# Altium project MB672.PrjPCB (part 2 of 2)

## Sheet SD&Smart Card.SchDoc
size A4; Revision: D.1(PCB.SCH)
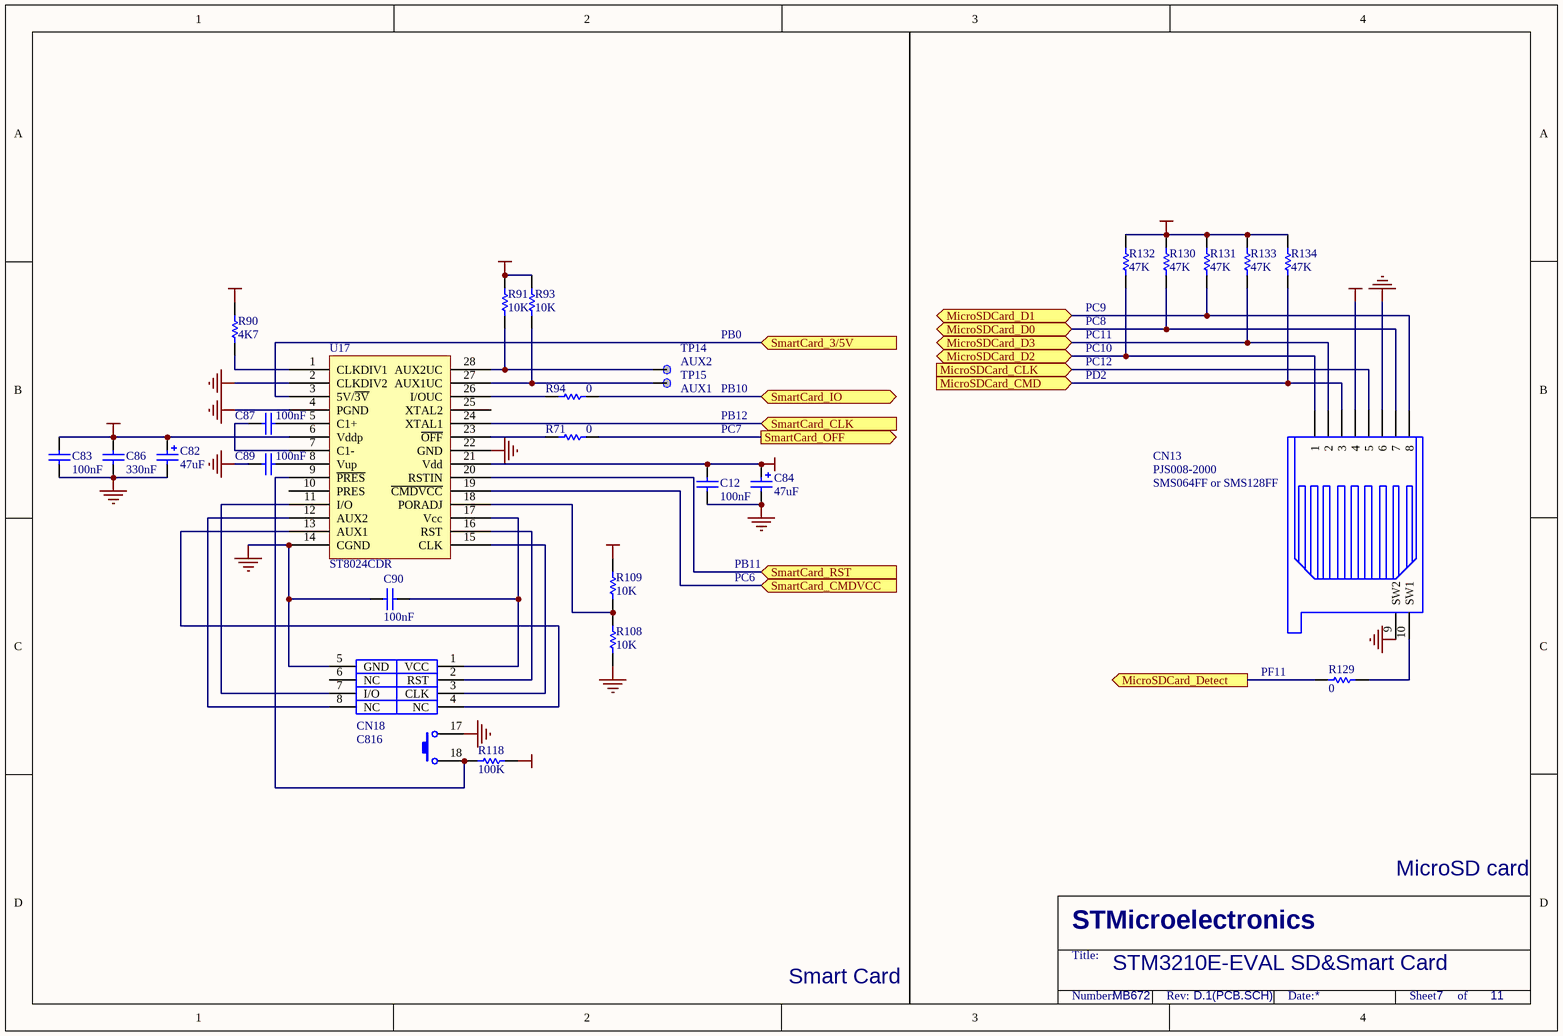
[diagram p9: SD&Smart Card.SchDoc]

### Parts
C12  100nF  [0603P]
C82  47uF  [TAN-B]
C83  100nF  [0603P]
C84  47uF  [TAN-B]
C86  330nF  [0603]
C87  100nF  [0603P]
C89  100nF  [0603P]
C90  100nF  [0603P]
CN13  PJS008-2000  [MSD(PJS008)]
CN18  C816  [SAM(C816)]
R71  0  [0805]
R90  4K7  [0603]
R91  10K  [0603]
R93  10K  [0603]
R94  0  [0805]
R108  10K  [0603]
R109  10K  [0603]
R118  100K  [0603]
R129  0  [0603]
R130  47K  [0805]
R131  47K  [0805]
R132  47K  [0805]
R133  47K  [0805]
R134  47K  [0805]
TP14  AUX2  [TP]
TP15  AUX1  [TP]
U17  ST8024CDR  [SO28]

### Ports
MicroSDCard_CLK (in), MicroSDCard_CMD (in), MicroSDCard_D0 (bidir), MicroSDCard_D1 (bidir), MicroSDCard_D2 (bidir), MicroSDCard_D3 (bidir), MicroSDCard_Detect (out), SmartCard_3/5V (in), SmartCard_CLK (in), SmartCard_CMDVCC (in), SmartCard_IO (bidir), SmartCard_OFF (out), SmartCard_RST (in)

### Nets
+3V3: C12.1 C84.1 CN13.4 R90.1 R91.1 R93.1 R109.1 R118.1 R130.1 R131.1 R132.1 R133.1 R134.1 U17.21(Vdd)
+5V: C82.1 C83.1 C86.1 U17.6(Vddp)
GND: C12.2 C82.2 C83.2 C84.2 C86.2 C89.2 C90.1 CN13.6 CN13.9(SW2) CN18.5(GND) CN18.17 R108.2 U17.2(CLKDIV2) U17.4(PGND) U17.14(CGND) U17.22(GND)
PB0: U17.3(5V/~{3V}) ; port SmartCard_3/5V
PB10: R94.2 ; port SmartCard_IO
PB11: U17.20(RSTIN) ; port SmartCard_RST
PB12: U17.24(XTAL1) ; port SmartCard_CLK
PC9: CN13.8 R131.2 ; port MicroSDCard_D1
PC10: CN13.1 R132.2 ; port MicroSDCard_D2
PC11: CN13.2 R133.2 ; port MicroSDCard_D3
PC12: CN13.5 ; port MicroSDCard_CLK
PD2: CN13.3 R134.2 ; port MicroSDCard_CMD
PF11: R129.1 ; port MicroSDCard_Detect
NetC87_1: C87.1 U17.7(C1-)
NetC87_2: C87.2 U17.5(C1+)
NetC89_1: C89.1 U17.8(Vup)
NetC90_2: C90.2 CN18.1(VCC) U17.17(Vcc)
NetCN13_7: CN13.7 R130.2 ; port MicroSDCard_D0
NetCN13_10: CN13.10(SW1) R129.2
NetCN18_2: CN18.2(RST) U17.16(RST)
NetCN18_3: CN18.3(CLK) U17.15(CLK)
NetCN18_4: CN18.4(NC) U17.13(AUX1)
NetCN18_7: CN18.7(I/O) U17.11(I/O)
NetCN18_8: CN18.8(NC) U17.12(AUX2)
NetCN18_18: CN18.18 R118.2 U17.9(~{PRES})
NetJP15_2: U17.19(~{CMDVCC}) ; port SmartCard_CMDVCC
NetJP16_2: R71.1 ; port SmartCard_OFF
NetR71_2: R71.2 U17.23(~{OFF})
NetR90_2: R90.2 U17.1(CLKDIV1)
NetR91_2: R91.2 TP14.1 U17.28(AUX2UC)
NetR93_2: R93.2 TP15.1 U17.27(AUX1UC)
NetR94_1: R94.1 U17.26(I/OUC)
NetR108_1: R108.1 R109.2 U17.18(PORADJ)

Not connected (* = marked no-connect by the designer): CN18 6(NC); U17 10(PRES) 25(XTAL2)

### Notes on the sheet
- (near R132) PC9
- PB0
- (near R132) PC8
- PC10
- PC11
- PD2
- PC12
- PB12
- PC7
- PB10
- (near CN13) SMS064FF or SMS128FF
- PC6
- PB11
- PF11
- MicroSD card
- Smart Card
- STM3210E-EVAL SD&Smart Card
- MB672
- 7
- 11
- STMicroelectronics
- Title:
- Number:
- Rev:
- Date:
- Sheet       of

### Library data of the parts
C12 C83 C87 C89 C90 = CAP: Capacitor; Published: 8-Jun-2000; Revision: July-2002: Re-released for DXP Platform.; Publisher: Altium Limited; Value: 100nF
C82 C84 = Cap Pol1: Polarized Capacitor (Radial); Value: 100pF; Published: 8-Jun-2000; Revision: July-2002: Re-released for DXP Platform.; Publisher: Altium Limited
C86 = CAP: Capacitor; Value: 100nF; Published: 8-Jun-2000; Revision: July-2002: Re-released for DXP Platform.; Publisher: Altium Limited
CN13 = SMS016AFA5E
CN18 = Smart_card_CN
R71 R90 R91 R93 R94 R108 R109 R118 R129-R134 = Res1: Resistor; Value: 1K; Published: 8-Jun-2000; Revision: July-2002: Re-released for DXP Platform.; Publisher: Altium Limited
TP14 TP15 = TP
U17 = ST8024CTR

## Sheet LCD&Joystick.SchDoc
size A4; Revision: D.1(PCB.SCH)
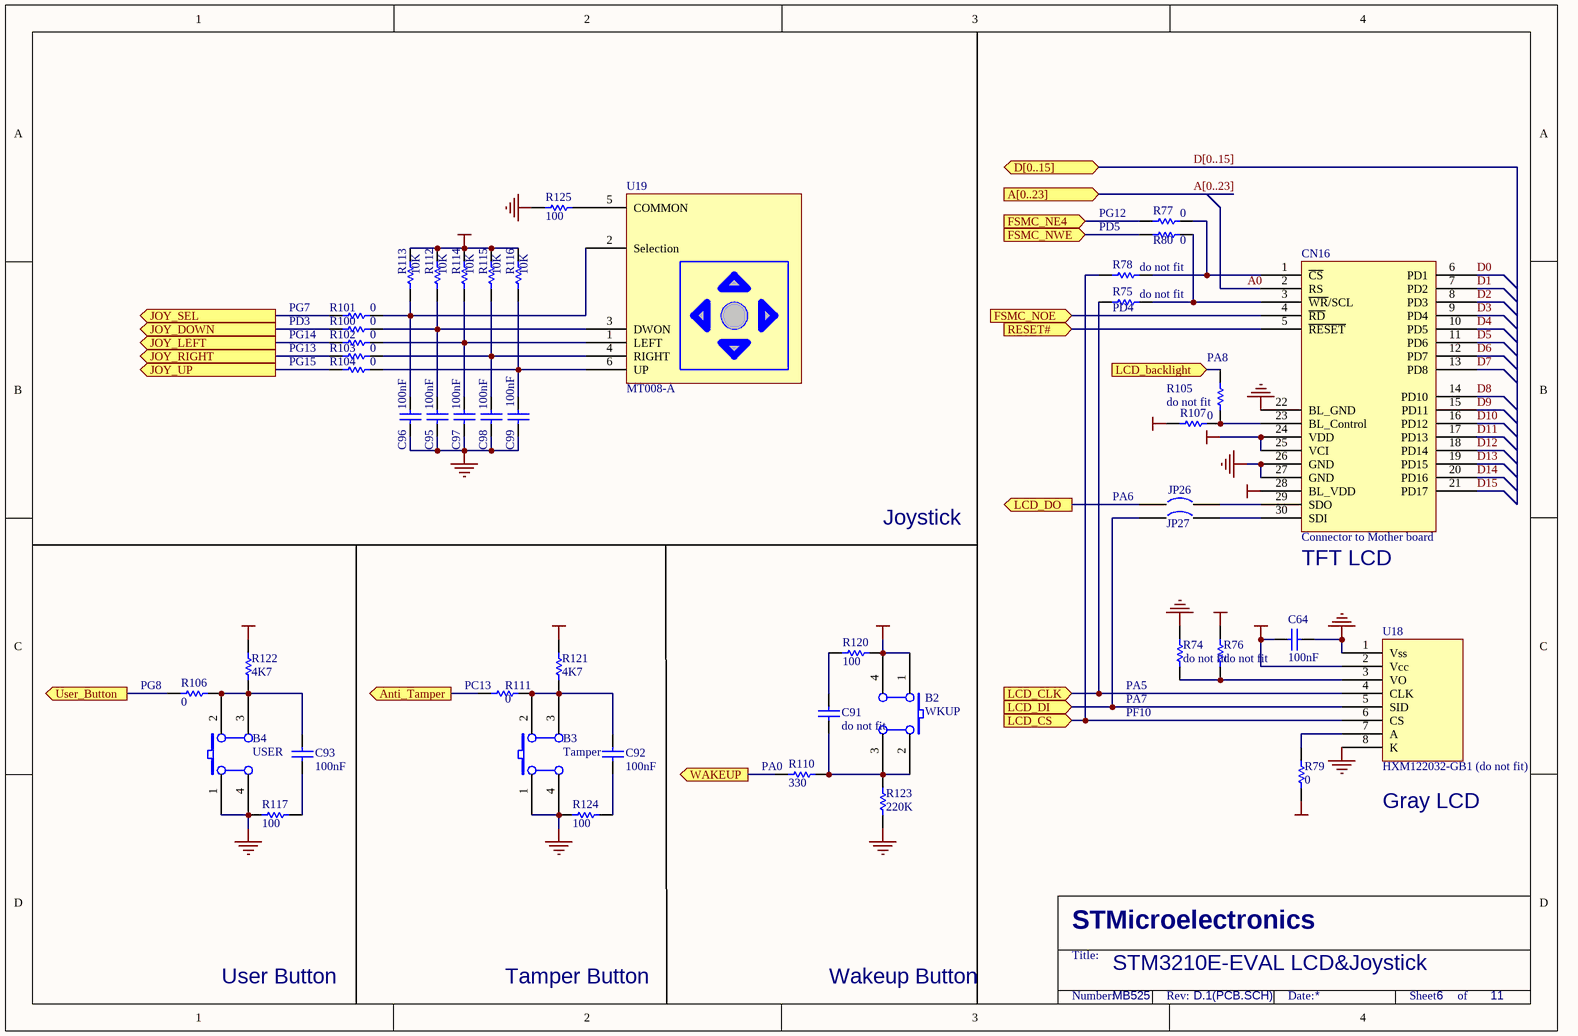
[diagram p10: LCD&Joystick.SchDoc]

### Parts
B2  WKUP  [PB10]
B3  Tamper  [PB10]
B4  USER  [PB10]
C64  100nF  [0603P]
C91  do not fit  [0603P]
C92  100nF  [0603P]
C93  100nF  [0603P]
C95  100nF  [0603P]
C96  100nF  [0603P]
C97  100nF  [0603P]
C98  100nF  [0603P]
C99  100nF  [0603P]
CN16  Connector to Mother board  [AM240320A]
JP26  (no value)  [SPST-2]
JP27  (no value)  [SPST-2]
R74  do not fit  [0603]
R75  do not fit  [0603]
R76  do not fit  [0603]
R77  0  [0603]
R78  do not fit  [0603]
R79  0  [0603]
R80  0  [0603]
R100  0  [0805]
R101  0  [0805]
R102  0  [0805]
R103  0  [0805]
R104  0  [0805]
R105  do not fit  [0603]
R106  0  [0805]
R107  0  [0603]
R110  330  [0805]
R111  0  [0805]
R112  10K  [0603]
R113  10K  [0603]
R114  10K  [0603]
R115  10K  [0603]
R116  10K  [0603]
R117  100  [0603]
R120  100  [0603]
R121  4K7  [0603]
R122  4K7  [0603]
R123  220K  [0603]
R124  100  [0603]
R125  100  [0603]
U18  HXM122032-GB1 (do not fit)  [LCD12232-GB1]
U19  MT008-A  [JOY]

### Ports
A[0..23] (in), Anti_Tamper (out), D[0..15] (bidir), FSMC_NE4 (in), FSMC_NOE (in), FSMC_NWE (in), JOY_DOWN (out), JOY_LEFT (out), JOY_RIGHT (out), JOY_SEL (out), JOY_UP (out), LCD_backlight (in), LCD_CLK (in), LCD_CS (in), LCD_DI (in), LCD_DO (out), RESET# (in), User_Button (out), WAKEUP (out)

### Nets
+3V3: B2.1(A0) B2.4(A1) C64.1 CN16.24(VDD) CN16.25(VCI) CN16.28(BL_VDD) R76.2 R107.2 R112.2 R113.1 R114.2 R115.2 R116.2 R120.1 R121.2 R122.2 U18.2(Vcc)
+5V: R79.1
GND: B3.1(A0) B3.4(A1) B4.1(A0) B4.4(A1) C64.2 C95.1 C96.1 C97.1 C98.1 C99.1 CN16.22(BL_GND) CN16.26(GND) CN16.27(GND) R74.1 R117.1 R123.2 R124.1 R125.1 U18.1(Vss) U18.8(K)
A0: CN16.2(RS)
D0: CN16.6(PD1)
D1: CN16.7(PD2)
D2: CN16.8(PD3)
D3: CN16.9(PD4)
D4: CN16.10(PD5)
D5: CN16.11(PD6)
D6: CN16.12(PD7)
D7: CN16.13(PD8)
D8: CN16.14(PD10)
D9: CN16.15(PD11)
D10: CN16.16(PD12)
D11: CN16.17(PD13)
D12: CN16.18(PD14)
D13: CN16.19(PD15)
D14: CN16.20(PD16)
D15: CN16.21(PD17)
PA0: R110.2 ; port WAKEUP
PA5: R75.2 U18.4(CLK) ; port LCD_CLK
PA6: JP26.1 ; port LCD_DO
PA7: JP27.1 U18.5(SID) ; port LCD_DI
PA8: R105.2 ; port LCD_backlight
PC13: R111.2 ; port Anti_Tamper
PD3: R100.2 ; port JOY_DOWN
PD4: CN16.4(~{RD}) ; port FSMC_NOE
PD5: R80.1 ; port FSMC_NWE
PF10: R78.1 U18.6(CS) ; port LCD_CS
PG7: R101.2 ; port JOY_SEL
PG8: R106.2 ; port User_Button
PG12: R77.1 ; port FSMC_NE4
PG13: R103.2 ; port JOY_RIGHT
PG14: R102.2 ; port JOY_LEFT
PG15: R104.2 ; port JOY_UP
RESET#: CN16.5(~{RESET}) ; port RESET#
NetB2_2: B2.2(B0) B2.3(B1) C91.2 R110.1 R123.1
NetB3_2: B3.2(B0) B3.3(B1) C92.2 R111.1 R121.1
NetB4_2: B4.2(B0) B4.3(B1) C93.2 R106.1 R122.1
NetC91_1: C91.1 R120.2
NetC92_1: C92.1 R124.2
NetC93_1: C93.1 R117.2
NetC95_2: C95.2 R100.1 R112.1 U19.3(DWON)
NetC96_2: C96.2 R101.1 R113.2 U19.2(Selection)
NetC97_2: C97.2 R102.1 R114.1 U19.1(LEFT)
NetC98_2: C98.2 R103.1 R115.1 U19.4(RIGHT)
NetC99_2: C99.2 R104.1 R116.1 U19.6(UP)
NetCN16_1: CN16.1(~{CS}) R77.2 R78.2
NetCN16_3: CN16.3(~{WR}/SCL) R75.1 R80.2
NetCN16_23: CN16.23(BL_Control) R105.1 R107.1
NetCN16_29: CN16.29(SDO) JP26.2
NetCN16_30: CN16.30(SDI) JP27.2
NetR74_2: R74.2 R76.1 U18.3(VO)
NetR79_2: R79.2 U18.7(A)
NetR125_2: R125.2 U19.5(COMMON)

### Buses and harness runs
bus A[0..23] = port A[0..23]
bus D[0..15] = port D[0..15]

### Notes on the sheet
- PG12
- PD5
- PG7
- (near R75) PD4
- PD3
- PG14
- PG13
- PG15
- (near R105) PA8
- PA6
- Joystick
- (near CN16) TFT LCD
- (near R106) PG8
- (near R111) PC13
- (near R74) PA5
- (near R74) PA7
- (near R74) PF10
- (near R110) PA0
- (near U18) Gray LCD
- User Button
- Tamper Button
- Wakeup Button
- STM3210E-EVAL LCD&Joystick
- MB525
- 6
- 11
- STMicroelectronics
- Title:
- Number:
- Rev:
- Date:
- Sheet       of

### Library data of the parts
B2-B4 = SW PUSHBUTTON: SE PUSHBUTTON
C64 C91-C93 C95-C99 = CAP: Capacitor; Value: 100pF; Published: 8-Jun-2000; Revision: July-2002: Re-released for DXP Platform.; Publisher: Altium Limited
CN16 = ColorLCD_module
JP26 JP27 = Circuit Breaker: Published: 24-Mar-1999; Revision: July-2002: Re-released for DXP Platform.; Publisher: Altium Limited
R74-R80 R100-R107 R110-R117 R120 R124 R125 = Res1: Resistor; Value: 1K; Published: 8-Jun-2000; Revision: July-2002: Re-released for DXP Platform.; Publisher: Altium Limited
R121-R123 = res1: Resistor; Value: 1K; Published: 8-Jun-2000; Revision: July-2002: Re-released for DXP Platform.; Publisher: Altium Limited
U18 = HXM122032-GB1
U19 = MT-008A

## Nets that join several sheets
+3V3: Audio (9 pins), SRAM&Flash (23 pins), RS232&IrDA (10 pins), Peripherals (17 pins), MotorCtrl (CN1.28 R7.2), Power (6 pins), JTAG&SWD (8 pins), MCU (6 pins), SD&Smart Card (14 pins), LCD&Joystick (17 pins)
+5V: MotorCtrl (CN1.25), Power (7 pins), MCU (CN6.1 CN6.2), SD&Smart Card (C82.1 C83.1 C86.1 U17.6), LCD&Joystick (R79.1)
D5V: Power (JP13.4), MCU (CN10.49 CN11.19)
GND: Audio (19 pins), SRAM&Flash (18 pins), RS232&IrDA (19 pins), Peripherals (43 pins), MotorCtrl (27 pins), Power (38 pins), JTAG&SWD (21 pins), MCU (28 pins), SD&Smart Card (16 pins), LCD&Joystick (20 pins)
U5V: Peripherals (C74.2 CN14.1 R70.1 U11.5), Power (JP13.2)
A0: SRAM&Flash (U1.A3 U2.E2), MCU (CN10.57 U8.10), LCD&Joystick (CN16.2)
A1: SRAM&Flash (U1.A4 U2.D2), MCU (CN10.60 U8.11)
A2: SRAM&Flash (U1.A5 U2.C2), MCU (CN10.61 U8.12)
A3: SRAM&Flash (U1.B3 U2.A2), MCU (CN10.62 U8.13)
A4: SRAM&Flash (U1.B4 U2.B2), MCU (CN10.63 U8.14)
A5: SRAM&Flash (U1.C3 U2.D3), MCU (CN10.64 U8.15)
A6: SRAM&Flash (U1.C4 U2.C3), MCU (CN11.43 U8.50)
A7: SRAM&Flash (U1.D4 U2.A3), MCU (CN11.44 U8.53)
A8: SRAM&Flash (U1.H2 U2.B6), MCU (CN11.41 U8.54)
A9: SRAM&Flash (U1.H3 U2.A6), MCU (CN11.42 U8.55)
A10: SRAM&Flash (U1.H4 U2.C6), MCU (CN11.40 U8.56)
A11: SRAM&Flash (U1.H5 U2.D6), MCU (CN11.37 U8.57)
A12: SRAM&Flash (U1.G3 U2.B7), MCU (CN11.8 U8.87)
A13: SRAM&Flash (U1.G4 U2.A7), MCU (CN11.7 U8.88)
A14: SRAM&Flash (U1.F3 U2.C7), MCU (CN11.6 U8.89)
A15: SRAM&Flash (U1.F4 U2.D7), MCU (CN11.5 U8.90)
A16: SRAM&Flash (U1.E4 U2.E7 U3.16), MCU (CN11.14 U8.80)
A17: SRAM&Flash (U1.D3 U2.B3 U3.17), MCU (CN11.13 U8.81)
A18: SRAM&Flash (U1.H1 U2.C4), MCU (CN11.12 U8.82)
A19: SRAM&Flash (U2.D5), JTAG&SWD (R49.2), MCU (CN10.52 U8.2)
A20: SRAM&Flash (U2.D4), JTAG&SWD (R60.2), MCU (CN10.51 U8.3)
A21: SRAM&Flash (U2.C5), JTAG&SWD (CN7.18), MCU (CN10.54 U8.4)
A22: SRAM&Flash (U2.B8), JTAG&SWD (CN7.20), MCU (CN10.53 U8.5)
A23: JTAG&SWD (CN7.12), MCU (CN10.23 U8.1)
D0: SRAM&Flash (U1.B6 U2.E3 U3.29), MCU (CN11.32 U8.85), LCD&Joystick (CN16.6)
D1: SRAM&Flash (U1.C5 U2.H3 U3.30), MCU (CN11.31 U8.86), LCD&Joystick (CN16.7)
D2: SRAM&Flash (U1.C6 U2.E4 U3.31), MCU (CN10.21 U8.114), LCD&Joystick (CN16.8)
D3: SRAM&Flash (U1.D5 U2.H4 U3.32), MCU (CN10.22 U8.115), LCD&Joystick (CN16.9)
D4: SRAM&Flash (U1.E5 U2.H5 U3.41), MCU (CN11.35 U8.58), LCD&Joystick (CN16.10)
D5: SRAM&Flash (U1.F5 U2.E5 U3.42), MCU (CN11.36 U8.59), LCD&Joystick (CN16.11)
D6: SRAM&Flash (U1.F6 U2.H6 U3.43), MCU (CN11.33 U8.60), LCD&Joystick (CN16.12)
D7: SRAM&Flash (U1.G6 U2.E6 U3.44), MCU (CN11.34 U8.63), LCD&Joystick (CN16.13)
D8: SRAM&Flash (U1.B1 U2.F3), MCU (CN11.29 U8.64), LCD&Joystick (CN16.14)
D9: SRAM&Flash (U1.C1 U2.G3), MCU (CN11.28 U8.65), LCD&Joystick (CN16.15)
D10: SRAM&Flash (U1.C2 U2.F4), MCU (CN11.27 U8.66), LCD&Joystick (CN16.16)
D11: SRAM&Flash (U1.D2 U2.G4), MCU (CN11.26 U8.67), LCD&Joystick (CN16.17)
D12: SRAM&Flash (U1.E2 U2.F5), MCU (CN11.25 U8.68), LCD&Joystick (CN16.18)
D13: SRAM&Flash (U1.F2 U2.G6), MCU (CN11.17 U8.77), LCD&Joystick (CN16.19)
D14: SRAM&Flash (U1.F1 U2.F6), MCU (CN11.16 U8.78), LCD&Joystick (CN16.20)
D15: SRAM&Flash (U1.G1 U2.G7), MCU (CN11.15 U8.79), LCD&Joystick (CN16.21)
NetC1_2: MotorCtrl (C1.2 CN1.31 JP2.1), MCU (JP4.1)
NetCN1_15: Peripherals (CN5.5 JP25.1), MotorCtrl (CN1.15 R5.2)
NetCN1_17: Peripherals (CN3.5 JP24.1), MotorCtrl (CN1.17 R4.2)
NetCN1_19: Peripherals (CN2.5 JP23.1), MotorCtrl (CN1.19 R3.2)
NetCN1_23: MotorCtrl (CN1.23), MCU (R2.2)
NetCN13_7: MCU (JP17.2), SD&Smart Card (CN13.7 R130.2)
NetJP3_2: MotorCtrl (R8.2), MCU (JP3.2)
NetJP4_3: RS232&IrDA (R30.2), MCU (JP4.3)
NetJP11_2: Peripherals (R46.2), MCU (JP11.2)
NetJP15_2: MCU (JP15.2), SD&Smart Card (U17.19)
NetJP16_2: MCU (JP16.2), SD&Smart Card (R71.1)
NetJP22_2: RS232&IrDA (R89.2), MCU (JP22.2)
NetR29_2: RS232&IrDA (R29.2), MCU (R31.2)
PA0: MCU (CN10.9 JP4.2 U8.34), LCD&Joystick (R110.2)
PA1: RS232&IrDA (U5.10), MotorCtrl (C4.2 CN1.33), MCU (CN11.61 U8.35)
PA2: RS232&IrDA (U5.11), MotorCtrl (C3.2 CN1.34), MCU (CN11.60 U8.36)
PA4: Audio (R67.2), MCU (CN11.57 U8.40)
PA5: Audio (R68.2), Peripherals (U6.6), MCU (CN6.4 CN11.56 U8.41), LCD&Joystick (R75.2 U18.4)
PA6: Peripherals (R37.1), MCU (CN6.8 CN11.55 JP3.1 U8.42), LCD&Joystick (JP26.1)
PA7: Peripherals (U6.5), MotorCtrl (CN1.5), MCU (CN6.6 CN11.54 U8.43), LCD&Joystick (JP27.1 U18.5)
PA8: Audio (R57.2), MCU (CN6.11 CN10.6 TP11.1 U8.100), LCD&Joystick (R105.2)
PA9: RS232&IrDA (U7.11), MCU (CN10.7 U8.101)
PA10: RS232&IrDA (R36.2), MCU (CN10.8 U8.102)
PA11: Peripherals (R81.1), MCU (CN10.12 U8.103)
PA12: Peripherals (R82.1), MCU (CN10.13 U8.104)
PA13: JTAG&SWD (CN7.2 CN9.7 R58.1), MCU (CN10.14 U8.105)
PA14: JTAG&SWD (CN7.4 CN9.9 R54.2), MCU (CN10.15 U8.109)
PA15: JTAG&SWD (CN7.8 CN9.5 R59.1), MCU (CN10.16 U8.110)
PB0: MotorCtrl (CN1.9), MCU (CN11.51 U8.46), SD&Smart Card (U17.3)
PB1: MotorCtrl (CN1.13), MCU (CN6.7 CN11.47 U8.47)
PB2: Peripherals (R35.2), MCU (CN11.45 R43.1 U8.48)
PB3: JTAG&SWD (CN7.6 CN9.13 R50.2 R53.1), MCU (CN10.40 U8.133)
PB4: MotorCtrl (C51.2 JP20.2), JTAG&SWD (CN9.3 JP19.1 R61.2 R64.1), MCU (CN10.41 U8.134)
PB5: MotorCtrl (C5.2 CN1.29), MCU (CN6.10 CN10.42 JP11.1 U8.135)
PB6: Audio (U10.9), Peripherals (R44.2), MCU (CN6.3 CN10.43 U8.136)
PB7: Audio (U10.10), Peripherals (R38.2), MCU (CN6.5 CN10.44 U8.137)
PB8: Peripherals (R32.2), MCU (CN10.45 U8.139)
PB9: Peripherals (U4.1), MCU (CN10.46 U8.140)
PB10: MCU (CN11.24 U8.69), SD&Smart Card (R94.2)
PB11: MCU (CN11.23 U8.70), SD&Smart Card (U17.20)
PB12: Audio (U10.13), MotorCtrl (CN1.21), MCU (CN11.22 U8.73), SD&Smart Card (U17.24)
PB13: Audio (U10.14), MCU (CN11.21 U8.74)
PB14: Peripherals (JP14.3), MCU (CN11.20 U8.75)
PB15: Audio (U10.11), MCU (CN11.18 U8.76)
PC0: MotorCtrl (C7.2 R6.2 R63.2), MCU (CN11.66 U8.26)
PC1: MotorCtrl (C22.2 R5.1), MCU (CN11.65 U8.27)
PC2: MotorCtrl (C13.2 R4.1), MCU (CN11.64 U8.28)
PC3: MotorCtrl (C9.2 R3.1), MCU (CN11.63 U8.29)
PC4: Peripherals (R126.1), MCU (CN11.53 U8.44)
PC5: MotorCtrl (C6.2 R1.2), MCU (CN11.52 U8.45)
PC6: Audio (R56.2), MotorCtrl (CN1.3), MCU (CN10.2 JP15.1 U8.96)
PC7: MotorCtrl (CN1.7), MCU (CN10.3 JP16.1 U8.97)
PC8: MotorCtrl (CN1.11), MCU (CN10.4 JP17.1 U8.98)
PC9: MCU (CN10.5 U8.99), SD&Smart Card (CN13.8 R131.2)
PC10: RS232&IrDA (U13.3), MCU (CN10.17 U8.111), SD&Smart Card (CN13.1 R132.2)
PC11: MCU (CN10.18 JP22.1 U8.112), SD&Smart Card (CN13.2 R133.2)
PC12: MCU (CN10.20 U8.113), SD&Smart Card (CN13.5)
PC13: MCU (CN10.56 R11.1 U8.7), LCD&Joystick (R111.2)
PD2: MotorCtrl (C60.2 CN1.27 JP20.1), MCU (CN10.25 U8.116), SD&Smart Card (CN13.3 R134.2)
PD3: MCU (CN10.26 U8.117), LCD&Joystick (R100.2)
PD4: SRAM&Flash (U1.A2 U2.G2 U3.8), MCU (CN10.27 U8.118), LCD&Joystick (CN16.4)
PD5: SRAM&Flash (U1.G5 U2.A5 U3.18), MCU (CN10.28 U8.119), LCD&Joystick (R80.1)
PD6: SRAM&Flash (JP7.1 R18.1 U2.A4), MCU (CN10.29 U8.122)
PD7: SRAM&Flash (R22.1), MCU (CN10.31 U8.123)
PE0: SRAM&Flash (U1.A1), MCU (CN10.47 U8.141)
PE1: SRAM&Flash (U1.B2), MCU (CN10.24 U8.142)
PF6: Peripherals (R96.2), MCU (CN10.65 U8.18)
PF7: Peripherals (R97.2), MCU (CN10.66 U8.19)
PF8: Peripherals (R98.2), MCU (CN10.67 U8.20)
PF9: Peripherals (R99.2), MCU (CN10.68 U8.21)
PF10: MCU (CN11.67 U8.22), LCD&Joystick (R78.1 U18.6)
PF11: MCU (CN6.9 CN11.46 U8.49), SD&Smart Card (R129.1)
PG6: SRAM&Flash (JP7.3 R17.1), MCU (CN11.4 U8.91)
PG7: MCU (CN11.3 U8.92), LCD&Joystick (R101.2)
PG8: MCU (CN11.2 U8.93), LCD&Joystick (R106.2)
PG9: SRAM&Flash (R21.1), MCU (CN10.32 U8.124)
PG10: SRAM&Flash (R15.1), MCU (CN10.33 U8.125)
PG11: Audio (R128.2), MCU (CN10.34 U8.126)
PG12: MCU (CN10.35 U8.127), LCD&Joystick (R77.1)
PG13: MCU (CN10.36 U8.128), LCD&Joystick (R103.2)
PG14: MCU (CN10.37 U8.129), LCD&Joystick (R102.2)
PG15: MCU (CN10.38 U8.132), LCD&Joystick (R104.2)
RESET#: JTAG&SWD (CN7.10 CN9.15 JP19.2), MCU (6 pins), LCD&Joystick (CN16.5)